# Altium schematic sheet Auxiliary Regulators.SchDoc
size A4; Organization: TESLA Motors, INC; Address1: 3500 Deer Creek Road; Address2: Palo Alto, CA; Address4: U.S.A.; SheetNumber: 10; SheetTotal: 21
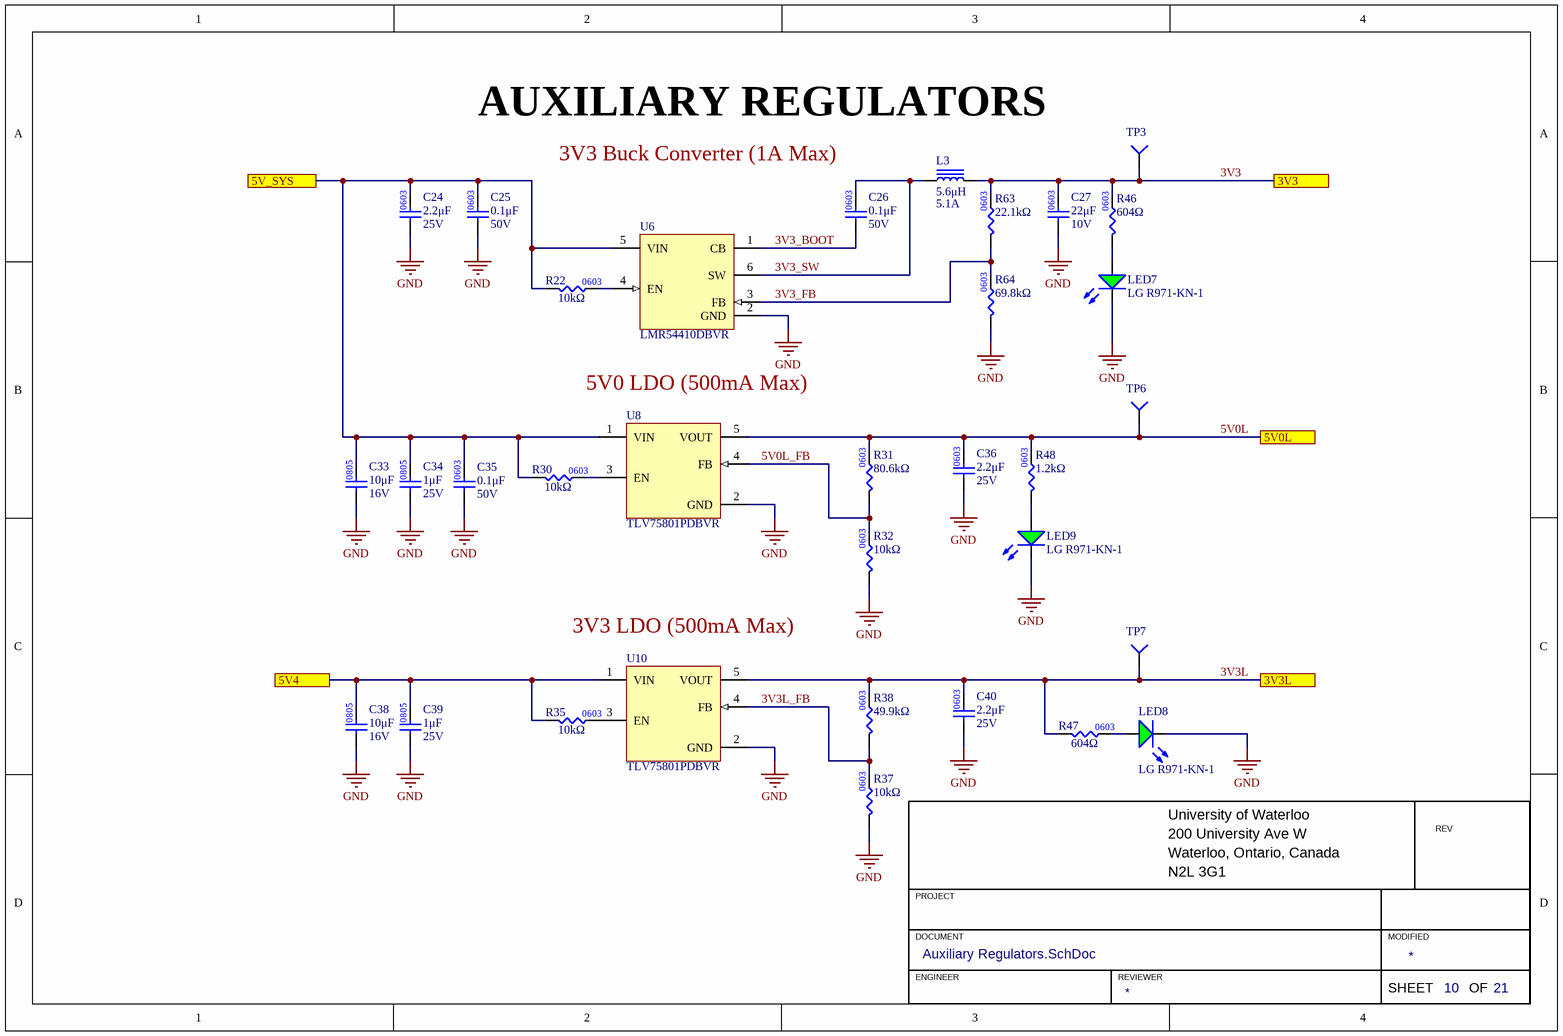
[diagram p0: Auxiliary Regulators.SchDoc]

## Parts
C24  value 2.2μF  Voltage Rating: 25V  [CAP0603]  (hidden comment: CAP_2.2uF_25V_0603)
C25  value 0.1μF  Voltage Rating: 50V  [CAP0603]  (hidden comment: CAP_0.1uF_50V_0603)
C26  value 0.1μF  Voltage Rating: 50V  [CAP0603]  (hidden comment: CAP_0.1uF_50V_0603)
C27  value 22μF  Voltage Rating: 10V  [CAP0603]  (hidden comment: CAP_22uF_10V_0603)
C33  value 10μF  Voltage Rating: 16V  [CAP0805]  (hidden comment: CAP_10uF_16V_0805)
C34  value 1μF  Voltage Rating: 25V  [CAP0805]  (hidden comment: CAP_1uF_25V_0805)
C35  value 0.1μF  Voltage Rating: 50V  [CAP0603]  (hidden comment: CAP_0.1uF_50V_0603)
C36  value 2.2μF  Voltage Rating: 25V  [CAP0603]  (hidden comment: CAP_2.2uF_25V_0603)
C38  value 10μF  Voltage Rating: 16V  [CAP0805]  (hidden comment: CAP_10uF_16V_0805)
C39  value 1μF  Voltage Rating: 25V  [CAP0805]  (hidden comment: CAP_1uF_25V_0805)
C40  value 2.2μF  Voltage Rating: 25V  [CAP0603]  (hidden comment: CAP_2.2uF_25V_0603)
L3  Current Rating: 5.1A  Inductance: 5.6μH  [IND_WURTH_4040]  (hidden comment: IND_5.6uH_5.1A)
LED7  Manufacturer Part Number 1: LG R971-KN-1  [LED_0805_GREEN]  (hidden comment: LED_GREEN)
LED8  Manufacturer Part Number 1: LG R971-KN-1  [LED_0805_GREEN]  (hidden comment: LED_GREEN)
LED9  Manufacturer Part Number 1: LG R971-KN-1  [LED_0805_GREEN]  (hidden comment: LED_GREEN)
R22  value 10kΩ  [RES0603]  (hidden comment: RES_10kΩ_0603_1%)
R30  value 10kΩ  [RES0603]  (hidden comment: RES_10kΩ_0603_1%)
R31  value 80.6kΩ  [RES0603]  (hidden comment: RES_80.6kΩ_0603_1%)
R32  value 10kΩ  [RES0603]  (hidden comment: RES_10kΩ_0603_1%)
R35  value 10kΩ  [RES0603]  (hidden comment: RES_10kΩ_0603_1%)
R37  value 10kΩ  [RES0603]  (hidden comment: RES_10kΩ_0603_1%)
R38  value 49.9kΩ  [RES0603]  (hidden comment: RES_49.9kΩ_0603_1%)
R46  value 604Ω  [RES0603]  (hidden comment: RES_604Ω_0603_1%)
R47  value 604Ω  [RES0603]  (hidden comment: RES_604Ω_0603_1%)
R48  value 1.2kΩ  [RES0603]  (hidden comment: RES_1.2kΩ_0603_1%)
R63  value 22.1kΩ  [RES0603]  (hidden comment: RES_22.1kΩ_0603_1%)
R64  value 69.8kΩ  [RES0603]  (hidden comment: RES_69.8kΩ_0603_1%)
TP3  TESTPOINT_KEYSTONE_LOOP  [KEYSTONE_5019]  (value not drawn)
TP6  TESTPOINT_KEYSTONE_LOOP  [KEYSTONE_5019]  (value not drawn)
TP7  TESTPOINT_KEYSTONE_LOOP  [KEYSTONE_5019]  (value not drawn)
U6  LMR54410DBVR  [SOT23-6]
U8  TLV75801PDBVR  [TI_SOT23-5]
U10  TLV75801PDBVR  [TI_SOT23-5]

## Ports
3V3 (see Top[1C], Lithium Battery Charger[3B], SD Card Interface[2B]), 3V3L (see Top[1C], Real Time Clock[1B]), 5V0L (see Top[1C], Throttle Interfaces[2B]), 5V4 (see Top[1C], OR Power Switch[1B], System Voltage Regulators[4B]), 5V_SYS (see Top[1C], OR Power Switch[4B], TFT Display Interface[2C])

## Nets
GND: C24.1 C25.1 C27.1 C33.1 C34.1 C35.1 C36.1 C38.1 C39.1 C40.1 LED7.2(K) LED8.2(K) LED9.2(K) R32.1 R37.1 R64.1 U6.2(GND) U8.2(GND) U10.2(GND)
3V3: C27.2 L3.2 R46.2 R63.2 TP3.1(=value) ; port 3V3
3V3_BOOT: C26.1 U6.1(CB)
3V3_FB: R63.1 R64.2 U6.3(FB)
3V3_SW: C26.2 L3.1 U6.6(SW)
3V3L: C40.2 R38.2 R47.1 TP7.1(=value) U10.5(VOUT) ; port 3V3L
3V3L_FB: R37.2 R38.1 U10.4(FB)
5V0L: C36.2 R31.2 R48.2 TP6.1(=value) U8.5(VOUT) ; port 5V0L
5V0L_FB: R31.1 R32.2 U8.4(FB)
5V4: C38.2 C39.2 R35.1 U10.1(VIN) ; port 5V4
5V_SYS: C24.2 C25.2 C33.2 C34.2 C35.2 R22.1 R30.1 U6.5(VIN) U8.1(VIN) ; port 5V_SYS
NetLED7_1: LED7.1(A) R46.1
NetLED8_1: LED8.1(A) R47.2
NetLED9_1: LED9.1(A) R48.1
NetR22_2: R22.2 U6.4(EN)
NetR30_2: R30.2 U8.3(EN)
NetR35_2: R35.2 U10.3(EN)

## Notes on the sheet
- AUXILIARY REGULATORS
- (near C26) 3V3 Buck Converter (1A Max)
- 5V0 LDO (500mA Max)
- (near U10) 3V3 LDO (500mA Max)
- University of Waterloo
- 200 University Ave W
- REV
- PROJECT
- Waterloo, Ontario, Canada
- N2L 3G1
- DOCUMENT
- ENGINEER
- REVIEWER
- MODIFIED
- SHEET
- OF
- (in symbol CAP_1uF_25V_0805) 0805
- (in symbol CAP_2.2uF_25V_0603) 0603
- (in symbol RES_22.1kΩ_0603_1%) 0603
- (in symbol RES_49.9kΩ_0603_1%) 0603
- (in symbol RES_80.6kΩ_0603_1%) 0603
- (in symbol RES_604Ω_0603_1%) 0603

## Library data of the parts
C24 C36 C40 = CAP_2.2uF_25V_0603: CAP CER 2.2UF 25V X5R 0603; Manufacturer Part Number 1: C1608X5R1E225K080AB; Manufacturer 1: TDK Corporation; Dielectric: 5; Supplier Part Number 1: 445-5964-1-ND; Supplier 1: Digi-Key
C25 C26 C35 = CAP_0.1uF_50V_0603: CAP CER 0.1UF 50V X7R 0603; Manufacturer Part Number 1: CC0603KRX7R9BB104; Manufacturer 1: Yageo; Package/Footprint: 0603; Supplier Part Number 1: 311-1344-1-ND; Supplier 1: Digi-Key; Mounting Type: SMD; Dielectric: X7R
C27 = CAP_22uF_10V_0603: CAP CER 22UF 10V X5R 0603; Manufacturer: Taiyo Yuden; Manufacturer Part Number: LMK107BBJ226MA-T; Supplier 1: Digi-Key; Supplier Part Number 1: 587-4913-1-ND; Package: 0603
C33 C38 = CAP_10uF_16V_0805: CAP CER 10UF 16V X5R 0805; Manufacturer 1: Yageo; Manufacturer Part Number 1: CC0805KKX5R7BB106; Package/Footprint: 0805; Supplier 1: Digi-Key; Supplier Part Number 1: 311-1865-1-ND; Mounting Type: SMD; Dielectric: X5R
C34 C39 = CAP_1uF_25V_0805: CAP CER 1UF 25V X7R 0805; Manufacturer 1: Murata; Manufacturer Part Number 1: GCM21BR71E105KA56L; Supplier 1: Digi-Key; Supplier Part Number 1: 490-4785-1-ND; Dielectric: X7R
L3 = IND_5.6uH_5.1A: POWER INDUCTOR 4040; 5.6 H; 5.1A; Manufacturer 1: Würth Elektronik; Manufacturer Part Number 1: 74439325056; DC Resistance (DCR): 44.4mOhm; Inductance Tolerance: 20%; Saturation Current: 5.5A; Supplier Part Number 1: 732-74439325056CT-ND; Supplier 1: Digi-Key; Mounting Type: SMD
LED7-LED9 = LED_GREEN: LED GREEN DIFFUSED 0805 SMD; Manufacturer 1: OSRAM; Forward Voltage Drop: 2.2V; Package/Footprint: 0805; Supplier Part Number 1: 475-1410-1-ND; Supplier 1: Digi-Key; Mounting Type: SMD
R22 R30 R32 R35 R37 = RES_10kΩ_0603_1%: RES 10K OHM 1% 1/8W 0603; Manufacturer 1: Stackpole Electronics Inc; Manufacturer Part Number 1: RNCP0603FTD10K0; Supplier Part Number 1: RNCP0603FTD10K0CT-ND; Supplier 1: Digi-Key; Mounting Type: SMD; Package: 0603
R31 = RES_80.6kΩ_0603_1%: RES 80.6K OHM 1% 1/10W 0603; Manufacturer 1: Stackpole Electronics Inc; Manufacturer Part Number 1: RMCF0603FT80K6; Supplier Part Number 1: RMCF0603FT80K6CT-ND; Supplier 1: Digi-Key
R38 = RES_49.9kΩ_0603_1%: RES 49.9K OHM 1% 1/10W 0603; Manufacturer 1: KOA Speer Electronics, Inc.; Manufacturer Part Number 1: RK73H1JTTD4992F; Supplier Part Number 1: 2019-RK73H1JTTD4992FCT-ND; Supplier 1: Digi-Key; Mounting Type: SMD
R46 R47 = RES_604Ω_0603_1%: RES 604 OHM 1% 1/10W 0603; Manufacturer 1: Yageo; Manufacturer Part Number 1: RC0603FR-07604RL; Supplier Part Number 1: 311-604HRCT-ND; Supplier 1: Digi-Key
R48 = RES_1.2kΩ_0603_1%: RES 1.2K OHM 1% 1/10W 0603; Manufacturer 1: Yageo; Manufacturer Part Number 1: RC0603FR-071K2L; Supplier Part Number 1: 311-1.20KHRCT-ND; Supplier 1: Digi-Key; Package: 0603
R63 = RES_22.1kΩ_0603_1%: RES 22.1K OHM 1% 1/10W 0603; Manufacturer 1: Stackpole Electronics Inc; Manufacturer Part Number 1: RMCF0603FT22K1; Supplier 1: Digi-Key; Supplier Part Number 1: RMCF0603FT22K1CT-ND
R64 = RES_69.8kΩ_0603_1%: RES 69.8K OHM 1% 1/10W 0603; Manufacturer 1: YAGEO; Manufacturer Part Number 1: RC0603FR-0769K8L; Package/Footprint: 0603; Mounting Type: SMD; Supplier 1: Digi-Key; Supplier Part Number 1: 311-69.8KHRCT-ND
TP3 TP6 TP7 = TESTPOINT_KEYSTONE_LOOP: PC TEST POINT MINIATURE; Manufacturer 1: Keystone Electronics; Manufacturer Part Number 1: 5019; Package/Footprint: SMD; Supplier 1: Digi-Key; Mounting Type: SMD; Supplier Part Number 1: 36-5019CT-ND
U6 = LMR54410DBVR: IC REG BUCK ADJ 1A SOT23-6; Manufacturer 1: Texas Instruments; Package/Footprint: SOT-23-6; Manufacturer Part Number 1: LMR54410DBVR; Supplier 1: Digikey; Supplier Part Number 1: 296-LMR54410DBVRCT-ND
U8 U10 = TLV75801PDBVR: IC REG LIN POS ADJ 500MA SOT23-5; Manufacturer 1: Texas Instruments; Input Voltage (Max): 6V; Package/Footprint: SOT-25; Output Current: 500mA; Operating Temperature: -40°C - 125°C; Supplier 1: Digi-Key; Supplier Part Number 1: 296-TLV75801PDBVRCT-ND; Manufacturer Part Number 1: TLV75801PDBVR